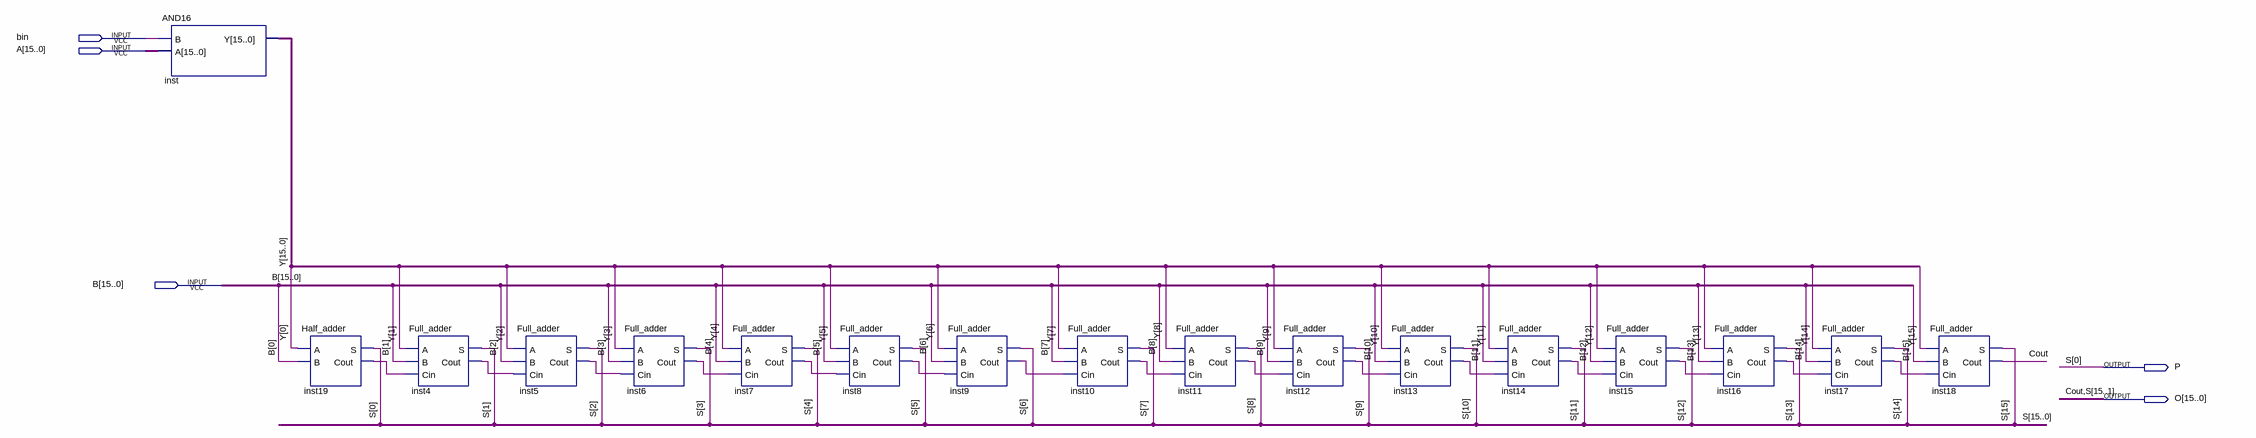
[diagram p0: schematic sheet]
// Quartus schematic adder16and2.bdf as structural Verilog: 17 symbols, 5 pins
module adder16and2 (
  input  bin,
  input  [15:0] A,
  input  [15:0] B,
  output P,
  output [15:0] O
);

  wire inst4_cout, inst5_cout, inst6_cout, inst7_cout, inst8_cout, inst9_cout, inst10_cout, inst11_cout,
       inst12_cout, inst13_cout, inst14_cout, inst15_cout, inst16_cout, inst17_cout, inst19_cout;
  wire [15:0] Y;

  AND16 inst (.B(bin), .A(A), .Y(Y));
  Half_adder inst19 (.A(Y[0]), .B(B[0]), .S(P), .Cout(inst19_cout));
  Full_adder inst4 (.A(Y[1]), .B(B[1]), .Cin(inst19_cout), .S(O[0]), .Cout(inst4_cout));
  Full_adder inst5 (.A(Y[2]), .B(B[2]), .Cin(inst4_cout), .S(O[1]), .Cout(inst5_cout));
  Full_adder inst6 (.A(Y[3]), .B(B[3]), .Cin(inst5_cout), .S(O[2]), .Cout(inst6_cout));
  Full_adder inst7 (.A(Y[4]), .B(B[4]), .Cin(inst6_cout), .S(O[3]), .Cout(inst7_cout));
  Full_adder inst8 (.A(Y[5]), .B(B[5]), .Cin(inst7_cout), .S(O[4]), .Cout(inst8_cout));
  Full_adder inst9 (.A(Y[6]), .B(B[6]), .Cin(inst8_cout), .S(O[5]), .Cout(inst9_cout));
  Full_adder inst10 (.A(Y[7]), .B(B[7]), .Cin(inst9_cout), .S(O[6]), .Cout(inst10_cout));
  Full_adder inst11 (.A(Y[8]), .B(B[8]), .Cin(inst10_cout), .S(O[7]), .Cout(inst11_cout));
  Full_adder inst12 (.A(Y[9]), .B(B[9]), .Cin(inst11_cout), .S(O[8]), .Cout(inst12_cout));
  Full_adder inst13 (.A(Y[10]), .B(B[10]), .Cin(inst12_cout), .S(O[9]), .Cout(inst13_cout));
  Full_adder inst14 (.A(Y[11]), .B(B[11]), .Cin(inst13_cout), .S(O[10]), .Cout(inst14_cout));
  Full_adder inst15 (.A(Y[12]), .B(B[12]), .Cin(inst14_cout), .S(O[11]), .Cout(inst15_cout));
  Full_adder inst16 (.A(Y[13]), .B(B[13]), .Cin(inst15_cout), .S(O[12]), .Cout(inst16_cout));
  Full_adder inst17 (.A(Y[14]), .B(B[14]), .Cin(inst16_cout), .S(O[13]), .Cout(inst17_cout));
  Full_adder inst18 (.A(Y[15]), .B(B[15]), .Cin(inst17_cout), .S(O[14]), .Cout(O[15]));

  // Other names for the same wires on the sheet: Cout = O[15]; S[15:0] = {O[14:0], P}
endmodule
